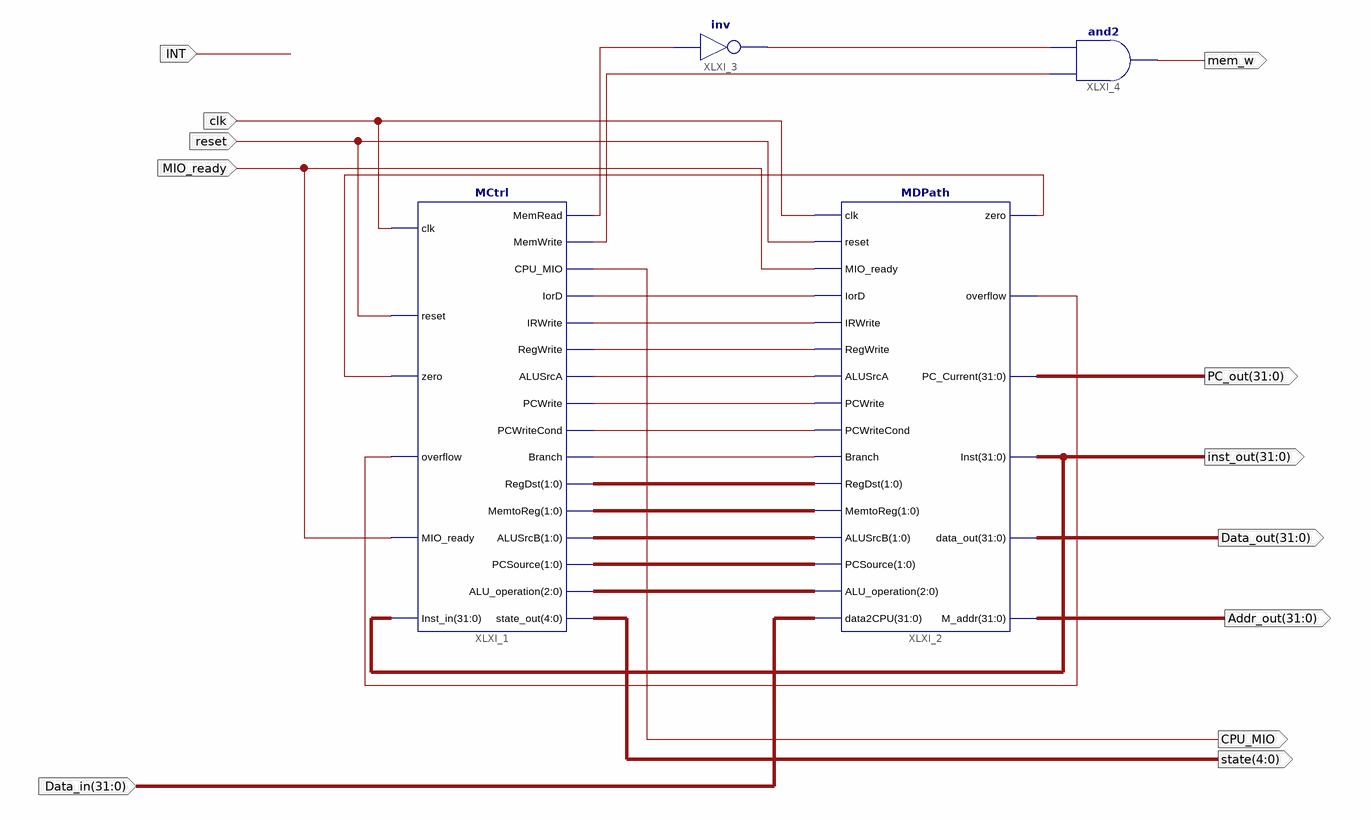
[diagram p0: schematic sheet 1]
// Xilinx ISE schematic MCPU.sch (kintex7) as structural Verilog: 4 symbols, 12 ports
module MCPU (
  input  INT,
  input  clk,
  input  reset,
  input  MIO_ready,
  input  [31:0] Data_in,
  output mem_w,
  output [31:0] inst_out,
  output CPU_MIO,
  output [4:0] state,
  output [31:0] Data_out,
  output [31:0] Addr_out,
  output [31:0] PC_out
);

  wire XLXN_1, XLXN_2, XLXN_3, XLXN_13, XLXN_14, XLXN_21, XLXN_22, XLXN_23, XLXN_24, XLXN_25, XLXN_26,
       XLXN_27;
  wire [1:0] XLXN_28, XLXN_29, XLXN_30, XLXN_31;
  wire [2:0] XLXN_32;

  MCtrl XLXI_1 (
    .zero(XLXN_13), .overflow(XLXN_14), .MIO_ready(MIO_ready), .Inst_in(inst_out), .MemRead(XLXN_1),
    .MemWrite(XLXN_2), .CPU_MIO(CPU_MIO), .IorD(XLXN_21), .IRWrite(XLXN_22), .RegWrite(XLXN_23),
    .ALUSrcA(XLXN_24), .PCWrite(XLXN_25), .PCWriteCond(XLXN_26), .Branch(XLXN_27), .RegDst(XLXN_28),
    .MemtoReg(XLXN_29), .ALUSrcB(XLXN_30), .PCSource(XLXN_31), .ALU_operation(XLXN_32), .state_out(state),
    .reset(reset), .clk(clk));
  MDPath XLXI_2 (
    .clk(clk), .reset(reset), .MIO_ready(MIO_ready), .IorD(XLXN_21), .IRWrite(XLXN_22), .RegWrite(XLXN_23),
    .ALUSrcA(XLXN_24), .PCWrite(XLXN_25), .PCWriteCond(XLXN_26), .Branch(XLXN_27), .RegDst(XLXN_28),
    .MemtoReg(XLXN_29), .ALUSrcB(XLXN_30), .PCSource(XLXN_31), .ALU_operation(XLXN_32), .data2CPU(Data_in),
    .zero(XLXN_13), .overflow(XLXN_14), .PC_Current(PC_out), .Inst(inst_out), .data_out(Data_out),
    .M_addr(Addr_out));
  not XLXI_3 (XLXN_3, XLXN_1);
  and XLXI_4 (mem_w, XLXN_2, XLXN_3);
endmodule
